# Altium project BULKHEAD.PrjPCB
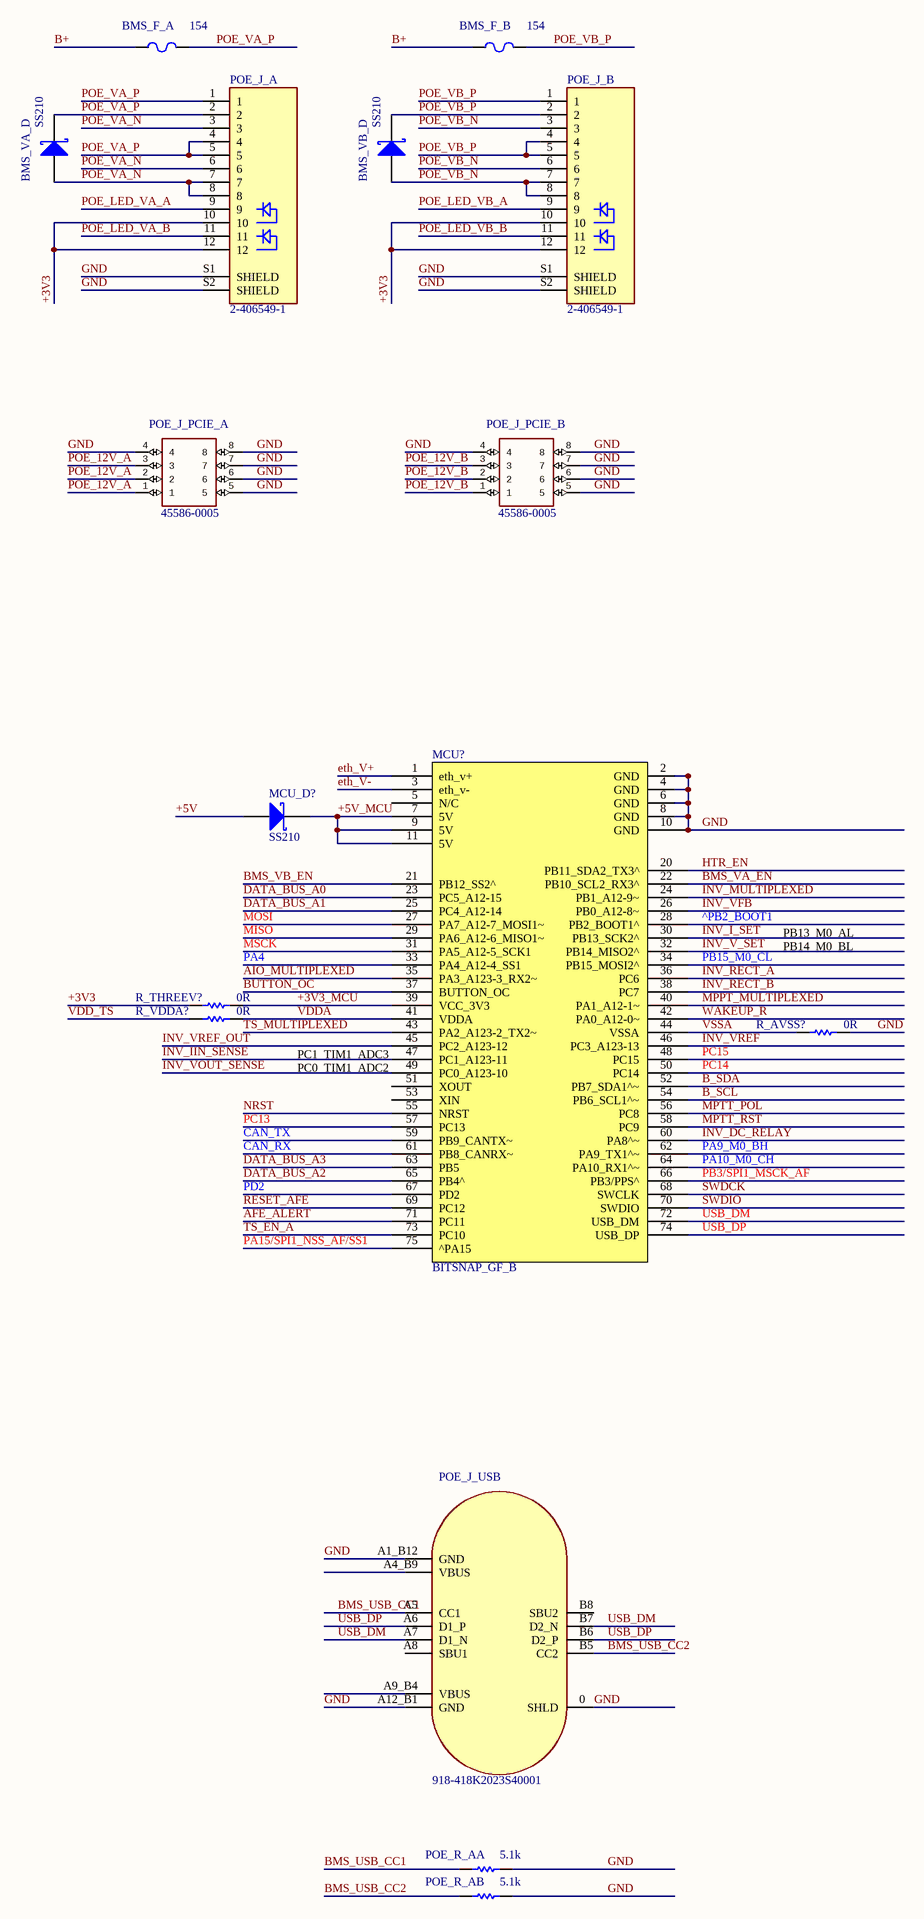
[diagram p0: BULKHEAD.SchDoc]
1 sheet, 16 parts. Net scope: global (net labels, ports and power ports of the same name join across sheets).
Board file: BULKHEAD.PcbDoc

## Sheet BULKHEAD.SchDoc
size D

### Parts
BMS_F_A  value 154  [01550900M]  (hidden comment: 01550900M)
BMS_F_B  value 154  [01550900M]  (hidden comment: 01550900M)
BMS_VA_D  SS210  [DO-214AC]
BMS_VB_D  SS210  [DO-214AC]
MCU?  BITSNAP_GF_B  [POWERNET-MAC]
MCU_D?  SS210  [DO-214AC]
POE_J_A  2-406549-1  [TE_2-406549-1]
POE_J_B  2-406549-1  [TE_2-406549-1]
POE_J_PCIE_A  45586-0005  [45586-000Y]
POE_J_PCIE_B  45586-0005  [45586-000Y]
POE_J_USB  918-418K2023S40001  [DX07S016JA1R1500]
POE_R_AA  value 5.1k  [R_0402]  (hidden comment: 0402WGF5101TCE)
POE_R_AB  value 5.1k  [R_0402]  (hidden comment: 0402WGF5101TCE)
R_AVSS?  value 0R  [R_0402]  (hidden comment: 0402WGF0000TCE)
R_THREEV?  value 0R  [R_0402]  (hidden comment: 0402WGF0000TCE)
R_VDDA?  value 0R  [R_0402]  (hidden comment: 0402WGF0000TCE)

### Nets
+3V3: POE_J_A.10 POE_J_A.12 POE_J_B.10 POE_J_B.12 R_THREEV?.1
+3V3_MCU: MCU?.39(VCC_3V3) R_THREEV?.2
+5V: MCU_D?.2(A)
+5V_MCU: MCU?.7(5V) MCU?.9(5V) MCU?.11(5V) MCU_D?.1(K)
^PB2_BOOT1: MCU?.28(PB2_BOOT1^)
AFE_ALERT: MCU?.71(PC11)
AIO_MULTIPLEXED: MCU?.35(PA3_A123-3_RX2~)
B+: BMS_F_A.1 BMS_F_B.1
B_SCL: MCU?.54(PB6_SCL1^~)
B_SDA: MCU?.52(PB7_SDA1^~)
BMS_USB_CC1: POE_J_USB.A5(CC1) POE_R_AA.1
BMS_USB_CC2: POE_J_USB.B5(CC2) POE_R_AB.1
BMS_VA_EN: MCU?.22(PB10_SCL2_RX3^)
BMS_VB_EN: MCU?.21(PB12_SS2^)
BUTTON_OC: MCU?.37(BUTTON_OC)
CAN_RX: MCU?.61(PB8_CANRX~)
CAN_TX: MCU?.59(PB9_CANTX~)
DATA_BUS_A0: MCU?.23(PC5_A12-15)
DATA_BUS_A1: MCU?.25(PC4_A12-14)
DATA_BUS_A2: MCU?.65(PB4^)
DATA_BUS_A3: MCU?.63(PB5)
eth_V+: MCU?.1(eth_v+)
eth_V-: MCU?.3(eth_v-)
GND: MCU?.2(GND) MCU?.4(GND) MCU?.6(GND) MCU?.8(GND) MCU?.10(GND) POE_J_A.S1(SHIELD) POE_J_A.S2(SHIELD) POE_J_B.S1(SHIELD) POE_J_B.S2(SHIELD) POE_J_PCIE_A.4 POE_J_PCIE_A.5 POE_J_PCIE_A.6 POE_J_PCIE_A.7 POE_J_PCIE_A.8 POE_J_PCIE_B.4 POE_J_PCIE_B.5 POE_J_PCIE_B.6 POE_J_PCIE_B.7 POE_J_PCIE_B.8 POE_J_USB.0(SHLD) POE_J_USB.A1_B12(GND) POE_J_USB.A12_B1(GND) POE_R_AA.2 POE_R_AB.2 R_AVSS?.2
HTR_EN: MCU?.20(PB11_SDA2_TX3^)
INV_DC_RELAY: MCU?.60(PA8^~)
INV_I_SET: MCU?.30(PB13_SCK2^)
INV_IIN_SENSE: MCU?.47(PC1_A123-11)
INV_MULTIPLEXED: MCU?.24(PB1_A12-9~)
INV_RECT_A: MCU?.36(PC6)
INV_RECT_B: MCU?.38(PC7)
INV_V_SET: MCU?.32(PB14_MISO2^)
INV_VFB: MCU?.26(PB0_A12-8~)
INV_VOUT_SENSE: MCU?.49(PC0_A123-10)
INV_VREF: MCU?.46(PC3_A123-13)
INV_VREF_OUT: MCU?.45(PC2_A123-12)
MISO: MCU?.29(PA6_A12-6_MISO1~)
MOSI: MCU?.27(PA7_A12-7_MOSI1~)
MPPT_MULTIPLEXED: MCU?.40(PA1_A12-1~)
MPTT_POL: MCU?.56(PC8)
MPTT_RST: MCU?.58(PC9)
MSCK: MCU?.31(PA5_A12-5_SCK1)
NRST: MCU?.55(NRST)
PA4: MCU?.33(PA4_A12-4_SS1)
PA9_M0_BH: MCU?.62(PA9_TX1^~)
PA10_M0_CH: MCU?.64(PA10_RX1^~)
PA15/SPI1_NSS_AF/SS1: MCU?.75(^PA15)
PB3/SPI1_MSCK_AF: MCU?.66(PB3/PPS^)
PB15_M0_CL: MCU?.34(PB15_MOSI2^)
PC13: MCU?.57(PC13)
PC14: MCU?.50(PC14)
PC15: MCU?.48(PC15)
PD2: MCU?.67(PD2)
POE_12V_A: POE_J_PCIE_A.1 POE_J_PCIE_A.2 POE_J_PCIE_A.3
POE_12V_B: POE_J_PCIE_B.1 POE_J_PCIE_B.2 POE_J_PCIE_B.3
POE_LED_VA_A: POE_J_A.9
POE_LED_VA_B: POE_J_A.11
POE_LED_VB_A: POE_J_B.9
POE_LED_VB_B: POE_J_B.11
POE_VA_N: BMS_VA_D.2(A) POE_J_A.3 POE_J_A.6 POE_J_A.7 POE_J_A.8
POE_VA_P: BMS_F_A.2 BMS_VA_D.1(K) POE_J_A.1 POE_J_A.2 POE_J_A.4 POE_J_A.5
POE_VB_N: BMS_VB_D.2(A) POE_J_B.3 POE_J_B.6 POE_J_B.7 POE_J_B.8
POE_VB_P: BMS_F_B.2 BMS_VB_D.1(K) POE_J_B.1 POE_J_B.2 POE_J_B.4 POE_J_B.5
RESET_AFE: MCU?.69(PC12)
SWDCK: MCU?.68(SWCLK)
SWDIO: MCU?.70(SWDIO)
TS_EN_A: MCU?.73(PC10)
TS_MULTIPLEXED: MCU?.43(PA2_A123-2_TX2~)
USB_DM: MCU?.72(USB_DM) POE_J_USB.A7(D1_N) POE_J_USB.B7(D2_N)
USB_DP: MCU?.74(USB_DP) POE_J_USB.A6(D1_P) POE_J_USB.B6(D2_P)
VDD_TS: R_VDDA?.1
VDDA: MCU?.41(VDDA) R_VDDA?.2
VSSA: MCU?.44(VSSA) R_AVSS?.1
WAKEUP_R: MCU?.42(PA0_A12-0~)

Not connected (* = marked no-connect by the designer): MCU? 5(N/C) 51(XOUT) 53(XIN); POE_J_USB A4_B9(VBUS) A8(SBU1) A9_B4(VBUS) B8(SBU2)

### Notes on the sheet
- PB13_M0_AL
- PB14_M0_BL
- (near MCU?) PC1_TIM1_ADC3
- (near MCU?) PC0_TIM1_ADC2

### Library data of the parts
BMS_F_A BMS_F_B = 01550900M: F - FUSE - FUSEHOLDER - 154 - SMD; JLC Availability: Extended; LCSC Part #: C108518
BMS_VA_D BMS_VB_D MCU_D? = SS210: D - DIODE - SCHOTTKY - 100V - 2A; Vrrm: 100; If: 2A; LCSC Part #: C14996; JLC Availability: Extended
MCU? = POWERNET_MAC: U - IC - Bitsnap CPU, NGFF B Key; Manufacturer: Foxconn; Manufacturer P/N: AS0BC21-S30BB-7H; LCSC Part #: C2761344
POE_J_A POE_J_B = 2-406549-1: J - JACK - ETHERNET - Right - THT; LCSC Part #: C125068; JLC Availability: Extended
POE_J_PCIE_A POE_J_PCIE_B = 45586-0005: J - JACK - MOLEX MINI-FIT JR PCIE; LCSC Part #: None; JLC Availability: None
POE_J_USB = 918-418K2023S40001: J - JACK - USB - Type C - Recepticle - SMT - 90°; JLC Availability: LCSC; LCSC Part #: C167321
POE_R_AA POE_R_AB = 0402WGF5101TCE: R - RESISTOR - SMD - 5.1k - 1% - 0402; LCSC Part #: C25905; JLC Availability: Basic
R_AVSS? R_THREEV? R_VDDA? = 0402WGF0000TCE: R - RESISTOR - SMD - 0R - 1% - 0402; LCSC Part #: C17168; JLC Availability: Basic